# Altium schematic sheet Power.SchDoc
size A3; SheetNumber: 1; SheetTotal: 3
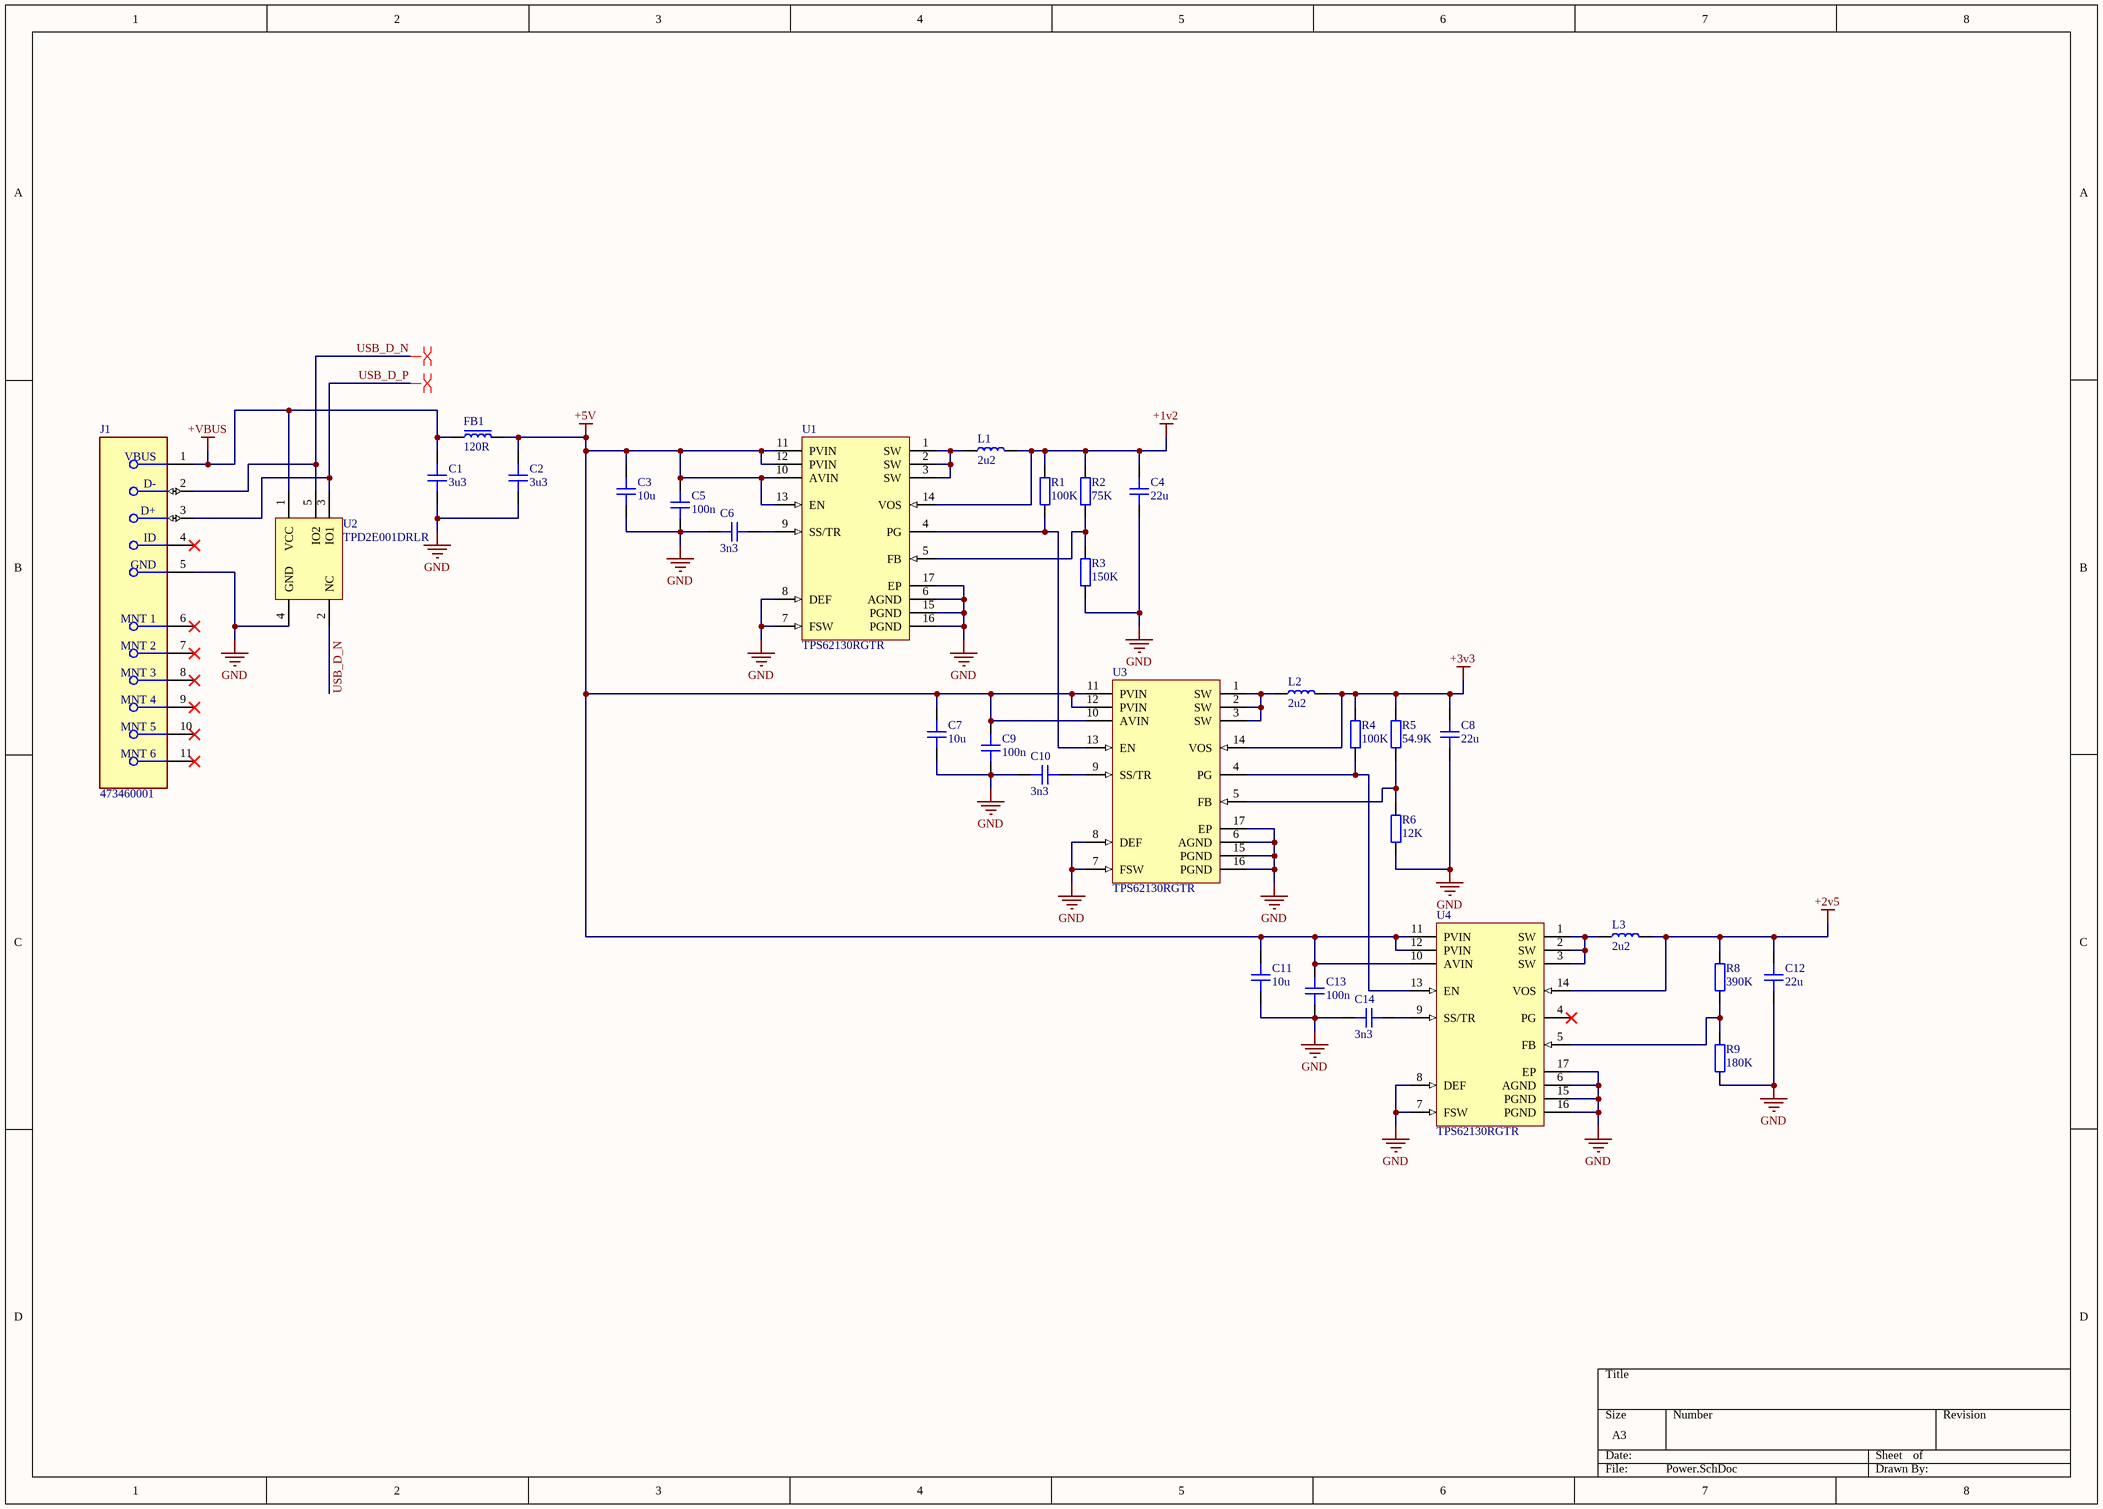
[diagram p0: Power.SchDoc]

## Parts
C1  3u3  [CAP_0603]
C2  3u3  [CAP_0603]
C3  10u  [CAP_0805]
C4  22u  [CAP_0805]
C5  100n  [CAP_0402]
C6  3n3  [CAP_0402]
C7  10u  [CAP_0805]
C8  22u  [CAP_0805]
C9  100n  [CAP_0402]
C10  3n3  [CAP_0402]
C11  10u  [CAP_0805]
C12  22u  [CAP_0805]
C13  100n  [CAP_0402]
C14  3n3  [CAP_0402]
FB1  120R  [FB_0603]
J1  473460001  [FP-473460001-MFG]
L1  2u2  [IND_1008]
L2  2u2  [IND_1008]
L3  2u2  [IND_1008]
R1  100K  [RES_0402]
R2  75K  [RES_0402]
R3  150K  [RES_0402]
R4  100K  [RES_0402]
R5  54.9K  [RES_0402]
R6  12K  [RES_0402]
R8  390K  [RES_0402]
R9  180K  [RES_0402]
U1  TPS62130RGTR  [RGT0016C_V]
U2  TPD2E001DRLR  [DRL0005A_L]
U3  TPS62130RGTR  [RGT0016C_V]
U4  TPS62130RGTR  [RGT0016C_V]

## Nets
+1v2: C4.2 L1.2 R1.2 R2.2 U1.14(VOS)
+2v5: C12.2 L3.2 R8.2 U4.14(VOS)
+3v3: C8.2 L2.2 R4.2 R5.2 U3.14(VOS)
+5V: C2.2 C3.2 C5.2 C7.2 C9.2 C11.2 C13.2 FB1.2 U1.10(AVIN) U1.11(PVIN) U1.12(PVIN) U1.13(EN) U3.10(AVIN) U3.11(PVIN) U3.12(PVIN) U4.10(AVIN) U4.11(PVIN) U4.12(PVIN)
+VBUS: C1.2 FB1.1 J1.1(VBUS) U2.1(VCC)
GND: C1.1 C2.1 C3.1 C4.1 C5.1 C6.2 C7.1 C8.1 C9.1 C10.2 C11.1 C12.1 C13.1 C14.2 J1.5(GND) R3.1 R6.1 R9.1 U1.6(AGND) U1.7(FSW) U1.8(DEF) U1.15(PGND) U1.16(PGND) U1.17(EP) U2.4(GND) U3.6(AGND) U3.7(FSW) U3.8(DEF) U3.15(PGND) U3.16(PGND) U3.17(EP) U4.6(AGND) U4.7(FSW) U4.8(DEF) U4.15(PGND) U4.16(PGND) U4.17(EP)
USB_D_N: J1.2(D-) U2.2(NC) U2.5(IO2)
USB_D_P: J1.3(D+) U2.3(IO1)
NetC6_1: C6.1 U1.9(SS/TR)
NetC10_1: C10.1 U3.9(SS/TR)
NetC14_1: C14.1 U4.9(SS/TR)
NetL1_1: L1.1 U1.1(SW) U1.2(SW) U1.3(SW)
NetL2_1: L2.1 U3.1(SW) U3.2(SW) U3.3(SW)
NetL3_1: L3.1 U4.1(SW) U4.2(SW) U4.3(SW)
NetR1_1: R1.1 U1.4(PG) U3.13(EN)
NetR2_1: R2.1 R3.2 U1.5(FB)
NetR4_1: R4.1 U3.4(PG) U4.13(EN)
NetR5_1: R5.1 R6.2 U3.5(FB)
NetR8_1: R8.1 R9.2 U4.5(FB)

Not connected (* = marked no-connect by the designer): J1 4(ID)* 6(MNT_1)* 7(MNT_2)* 8(MNT_3)* 9(MNT_4)* 10(MNT_5)* 11(MNT_6)*; U4 4(PG)*

## Layout directives
differential pair: USB_D_N, USB_D_P

## Library data of the parts
C1 C2 = CAP_0603: Capacitor SMD 0603; Manufacturer Part Number: TCC0603X5R335M250CT; Manufacturer: *; Distributor Link: *; LCSC: C5360803; Rating: *; Dielectric: *
C3 C7 C11 = CAP_0805: Capacitor SMD 0805; Manufacturer Part Number: CL21B106KOQNNNE; Manufacturer: *; Distributor Link: *; LCSC: C95841; Rating: *; Dielectric: *
C4 C8 C12 = CAP_0805: Capacitor SMD 0805; Manufacturer Part Number: GRM21BZ71A226ME15L; Manufacturer: *; Distributor Link: *; LCSC: C907991; Rating: *; Dielectric: *
C5 C9 C13 = CAP_0402: Capacitor SMD 0402; Manufacturer Part Number: CL05B104KO5NNNC; Manufacturer: *; Distributor Link: *; LCSC: C1525; Rating: *; Dielectric: *
C6 C10 C14 = CAP_0402: Capacitor SMD 0402; Manufacturer Part Number: CL05B332KB5NNNC; Manufacturer: *; Distributor Link: *; LCSC: C26404; Rating: *; Dielectric: *
FB1 = FB_0603: Ferrite Bead SMD 0603; Manufacturer Part Number: BLM18PG121SN1D; Manufacturer: *; Distributor Link: *; LCSC: C14709
J1 = CMP-2000-05246-2: CONN RCPT USB2.0 MICRO B SMD R/A; Manufacturer: Molex; Conn Orientation: Right Angle; Is Female: yes; Shielding: true; Pitch: 0.65mm; Number Of Contacts: 5; Voltage Rating: 30V; Current Rating: 1.8A; Device Class L2: USB Connectors; Digikey Description: CONN RCPT USB2.0 MICRO B SMD R/A; Height: 2.945mm; RoHS: TRUE; ComponentLink2Description: Datasheet; Octopart: https://octopart.com/47346-0001-molex-7164928; Automotive: No; Package: 0; Category: Conn; Device Class L1: Connectors; Usb Standard: USB 2.0; Temperature: -30°C to +85°C; Temperature Range Low: -30°C; Footprint Url: https://www.molex.com/pdm_docs/sd/473460001_sd.pdf; ComponentLink2URL: https://www.molex.com/webdocs/datasheets/pdf/en-us/0473460001_IO_CONNECTORS.pdf; Lead Free: Yes; Manufacturer Part Number: 473460001; Contact Material: Gold,Nickel; Temperature Range High: +85°C; Device Class L3: unset; LCSC: C132560
L1-L3 = IND_1008: Inductor SMD 1008; Manufacturer Part Number: LQM2HPN2R2MG0L; LCSC: C86092
R1 R4 = RES_0402: Resistor SMD 0402; Manufacturer Part Number: 0402WGF1003TCE; Manufacturer: *; Distributor Link: *; LCSC: C25741
R2 = RES_0402: Resistor SMD 0402; Manufacturer Part Number: 0402WGF7502TCE; Manufacturer: *; Distributor Link: *; LCSC: C25798
R3 = RES_0402: Resistor SMD 0402; Manufacturer Part Number: FRC0402F1503TS; Manufacturer: *; Distributor Link: *; LCSC: C2909320
R5 = RES_0402: Resistor SMD 0402; Manufacturer Part Number: 0402WGF5492TCE; Manufacturer: *; Distributor Link: *; LCSC: C11626
R6 = RES_0402: Resistor SMD 0402; Manufacturer Part Number: 0402WGF1202TCE; Manufacturer: *; Distributor Link: *; LCSC: C25752
R8 = RES_0402: Resistor SMD 0402; Manufacturer Part Number: 0402WGF3903TCE; Manufacturer: *; Distributor Link: *; LCSC: C25782
R9 = RES_0402: Resistor SMD 0402; Manufacturer Part Number: 0402WGF1803TCE; Manufacturer: *; Distributor Link: *; LCSC: C25760
U1 U3 U4 = CMP-0323-00115-3: Buck Step Down Regulator with 3 to 17 V Input and 0.9 to 6 V Output, -40 to 85 degC, 16-Pin QFN (RGT), Green (RoHS & no Sb/Br); Manufacturer: Texas Instruments; Rating: Catalog; Vout(Max)(V): 6; Vin(Min)(V): 3; Switch Current Limit(Typ)(A): 4.2; Iq(Typ)(mA): 0.017; Regulated Outputs(#): 1; Synchronous Rectification: TRUE; SubFamily: Step-Down Regulator; Vin(Max)(V): 17; Duty Cycle(Max)(%): 100; Vout(Min)(V): 0.9; ComponentLink2URL: http://www.ti.com/litv/pdf/mpqf119g; Eco-Plan: Green (RoHS & no Sb/Br); Manufacturer Part Number: TPS62130RGTR; ComponentLink1Description: Datasheet; DatasheetVersion: SLVSAG7; Mounting Technology: Surface Mount; Iout(Max)(A): 3; ComponentLink2Description: Package Specification; Code_JEDEC: MO-220; Topology: Buck; ComponentLink1URL: http://www.ti.com/general/docs/lit/getliterature.tsp?genericPartNumber=TPS62130&fileType=pdf; ComponentLink3URL: Samples URL:http://www.ti.com/product/tps62130#samples; ComponentLink3Description: URL Link1; PackageReference: RGT0016C; PackageVersion: revH, Oct-2011; PackageDescription: 16-Pin Plastic Quad Flat No-Lead, 3 x 3 mm Body, 0.5 mm Pitch, 1.7 x 1.7 mm Exposed Pad; LCSC: C43590
  U3: Parameter 1: *
U2 = CMP-0326-00048-3: Low-Capacitance + / - 15 kV ESD-Protection Array for High-Speed Data Interfaces, 2 Channels, -40 to +85 degC, 5-pin SOT (DRL), Green (RoHS & no Sb/Br); Manufacturer: Texas Instruments; IO Leakage Current(nA): 1; IEC 61000-4-2 Air-Gap(+/- kV): 15; IEC 61000-4-2 Contact(+/- kV): 8; SubFamily: ESD Solution; IO Capacitance(Typ)(pF): 1.5; Breakdown Voltage(Min)(V): 11; USB High Speed: TRUE; ComponentLink3Description: URL Link1; PackageReference: DRL0005A; Manufacturer Part Number: TPD2E001DRLR; PackageDescription: 5-Pin Plastic Small Outline, Flat Lead 0.5 mm Pitch; PackageVersion: revD, Aug-2007; DatasheetVersion: SLLS684F; ComponentLink1Description: Manufacturer URL; ComponentLink2Description: Datasheet; ComponentLink1URL: http://www.ti.com/; ComponentLink2URL: http://www.ti.com/general/docs/lit/getliterature.tsp?genericPartNumber=TPD2E001&fileType=pdf; ComponentLink3URL: SamplesURL:http://www.ti.com/product/tpd2e001#samples; Eco-Plan: Green (RoHS & no Sb/Br); Mounting Technology: Surface Mount; LCSC: C150526